# Altium project 23D_ESC_Controller.PrjPcb
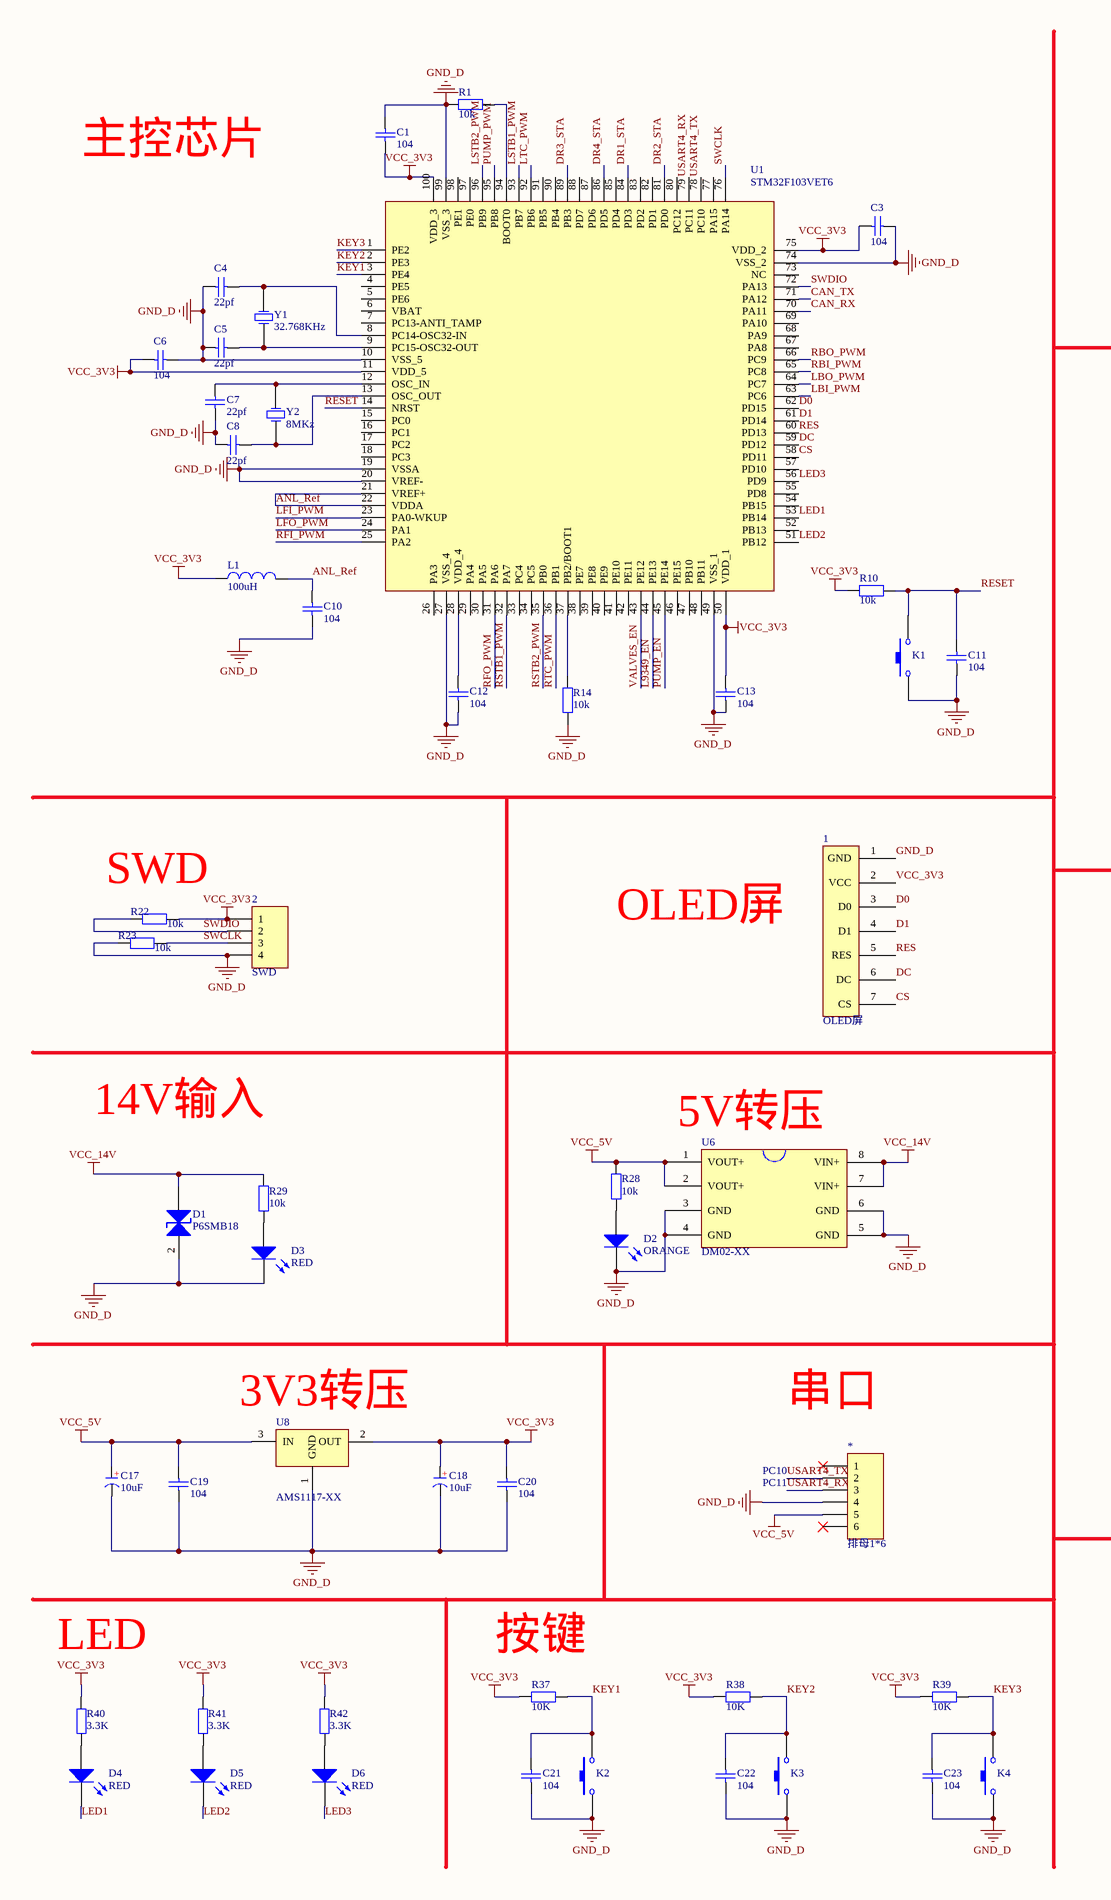
[diagram p0: 23D_ESC_Controller.SchDoc, left]
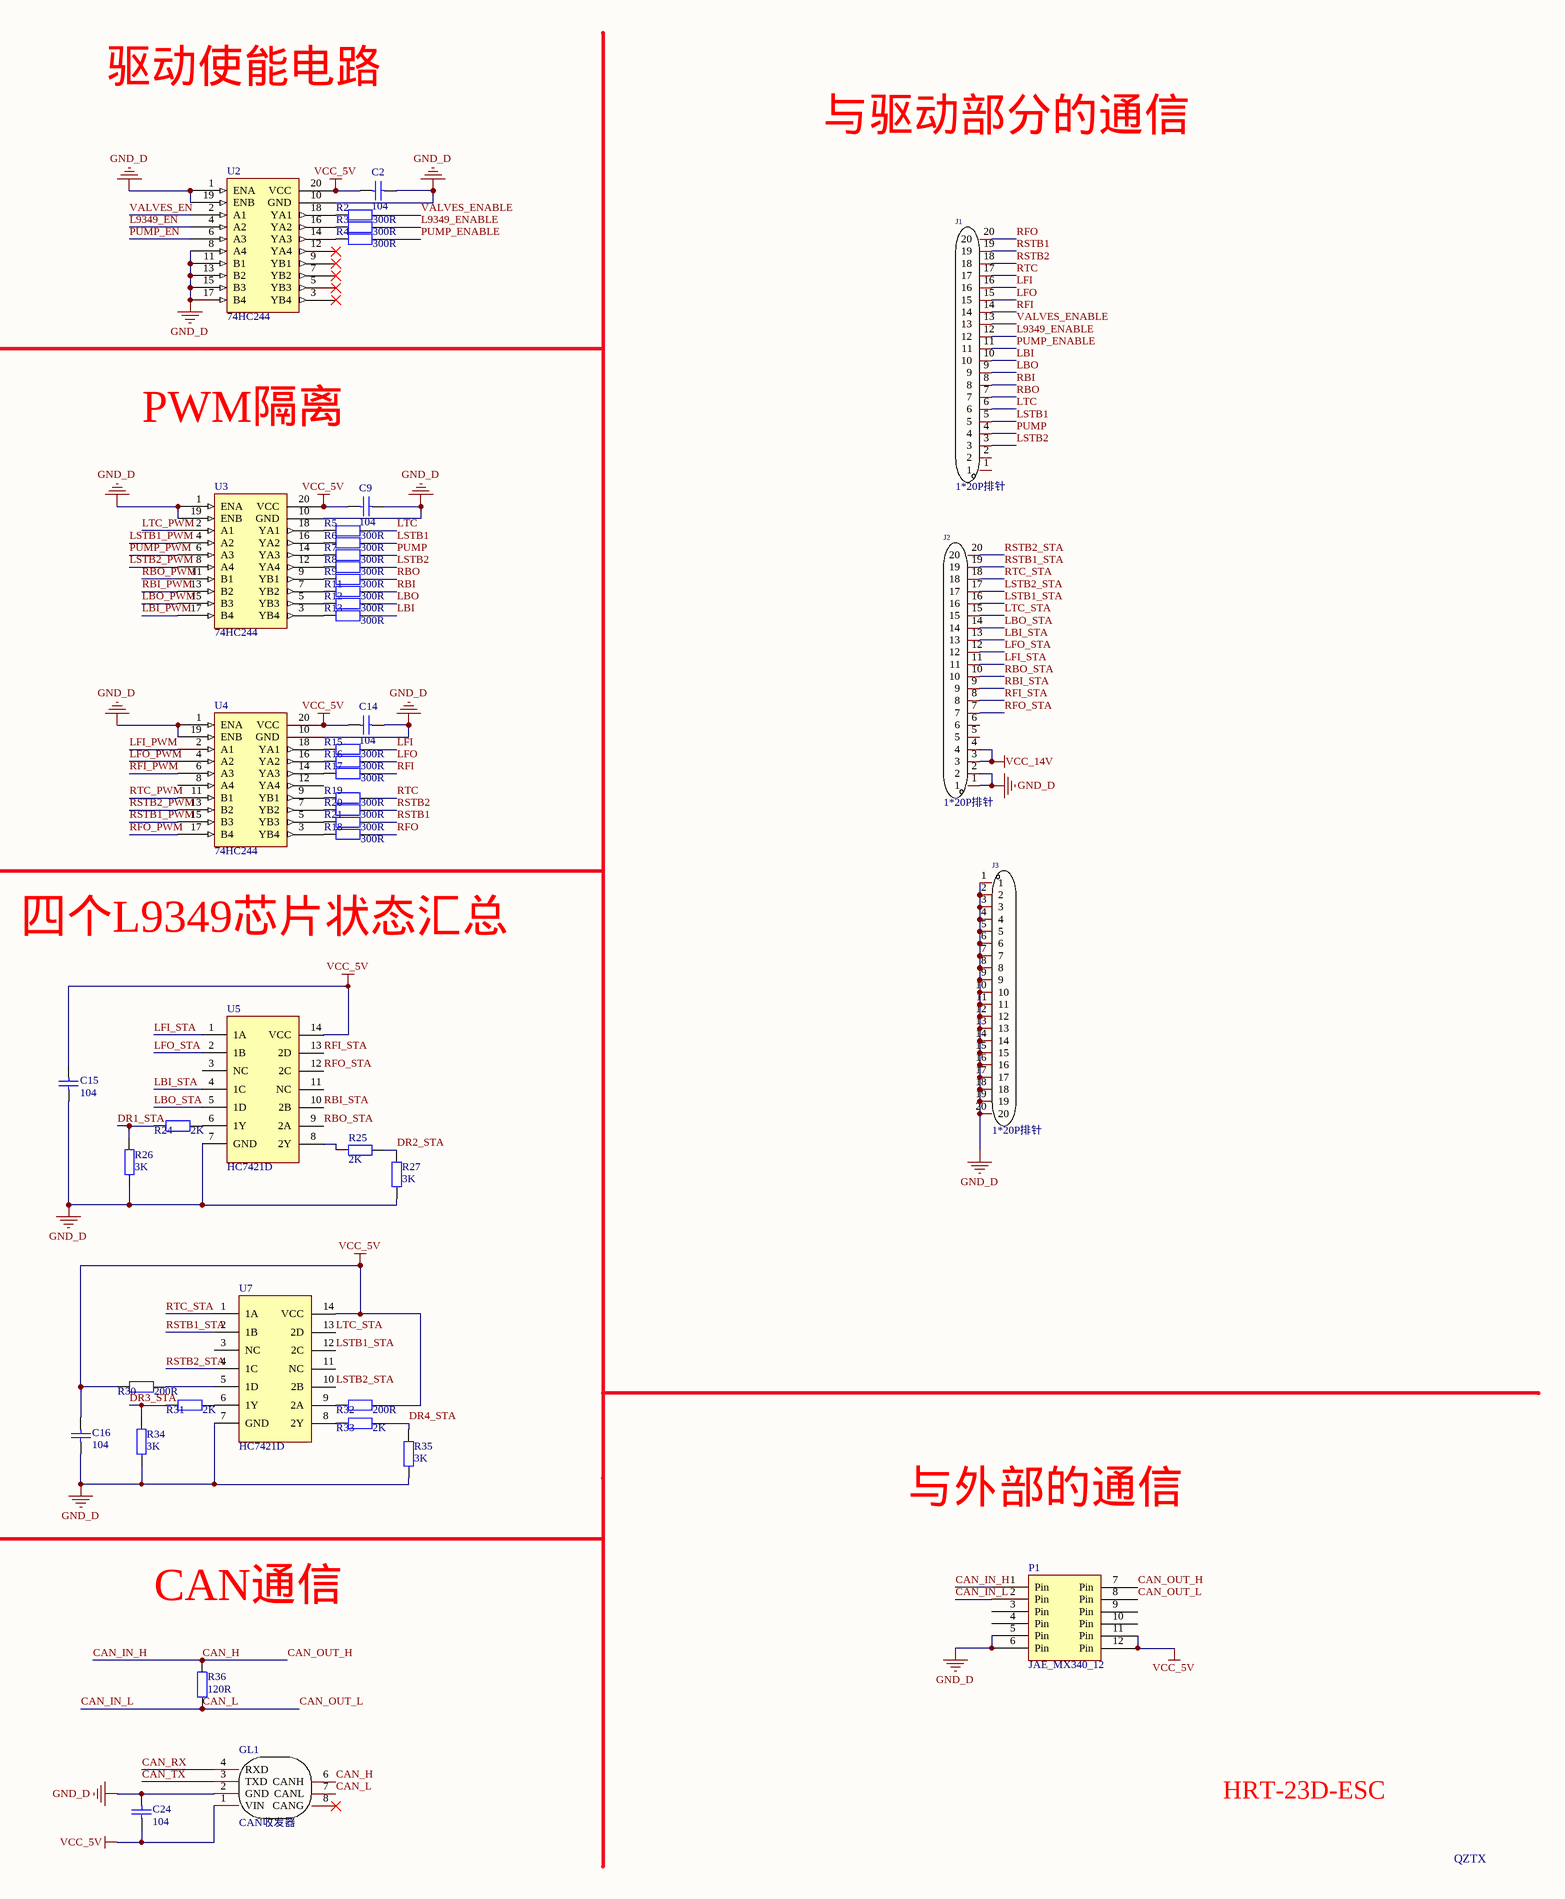
[diagram p1: 23D_ESC_Controller.SchDoc, right]
1 sheet, 95 parts. Net scope: global (net labels, ports and power ports of the same name join across sheets).
Board file: 23D_ESC_Controller.PcbDoc

## Sheet 23D_ESC_Controller.SchDoc
size A2

### Parts
1  OLED屏  [HDR2.54-M-LI-7P]
2  SWD  [HDR2.54-LI-4P]
*  排母1*6  [HDR2.54-M-LI-6P]
C1  104  [C 0805]
C2  104  [C 0805]
C3  104  [C 0805]
C4  22pf  [C 0805]
C5  22pf  [C 0805]
C6  104  [C 0805]
C7  22pf  [C 0805]
C8  22pf  [C 0805]
C9  104  [C 0805]
C10  104  [C 0805]
C11  104  [C 0805]
C12  104  [C 0805]
C13  104  [C 0805]
C14  104  [C 0805]
C15  104  [C 0805]
C16  104  [C 0805]
C17  10uF  [CD B(3528)]
C18  10uF  [CD B(3528)]
C19  104  [C 0805]
C20  104  [C 0805]
C21  104  [C 0805]
C22  104  [C 0805]
C23  104  [C 0805]
C24  104  [C 0805]
D1  P6SMB18  [DO-214AA]
D2  ORANGE  [LED_0805]
D3  RED  [LED_0805]
D4  RED  [LED_0805]
D5  RED  [LED_0805]
D6  RED  [LED_0805]
GL1  Name: CAN收发器  [COMM-TH_7P-L19.9-W17.5-P2.54]  (hidden comment: CTM1051KT)
J1  Name: 1*20P排针  [HDR-TH_20P-P2.54-V-M-1]  (hidden comment: 2.54-1*20P直针)
J2  Name: 1*20P排针  [HDR-TH_20P-P2.54-V-M-1]  (hidden comment: 2.54-1*20P直针)
J3  Name: 1*20P排针  [HDR2.54-LI-20P]  (hidden comment: 2.54-1*20P直针)
K1  Key  [KEY 3.6*2.5 SMD]  (value not drawn)
K2  Key  [KEY 3.6*2.5 SMD]  (value not drawn)
K3  Key  [KEY 3.6*2.5 SMD]  (value not drawn)
K4  Key  [KEY 3.6*2.5 SMD]  (value not drawn)
L1  100uH  [L 0805]
P1  JAE_MX340_12  [JAE_MX34_2.2_12]
R1  10k  [R 0805]
R2  300R  [R 0805]
R3  300R  [R 0805]
R4  300R  [R 0805]
R5  300R  [R 0805]
R6  300R  [R 0805]
R7  300R  [R 0805]
R8  300R  [R 0805]
R9  300R  [R 0805]
R10  10k  [R 0805]
R11  300R  [R 0805]
R12  300R  [R 0805]
R13  300R  [R 0805]
R14  10k  [R 0805]
R15  300R  [R 0805]
R16  300R  [R 0805]
R17  300R  [R 0805]
R18  300R  [R 0805]
R19  300R  [R 0805]
R20  300R  [R 0805]
R21  300R  [R 0805]
R22  10k  [R 0805]
R23  10k  [R 0805]
R24  2K  [R 0805]
R25  2K  [R 0805]
R26  3K  [R 0805]
R27  3K  [R 0805]
R28  10k  [R 0805]
R29  10k  [R 0805]
R30  200R  [R 0805]
R31  2K  [R 0805]
R32  200R  [R 0805]
R33  2K  [R 0805]
R34  3K  [R 0805]
R35  3K  [R 0805]
R36  120R  [R 0805]
R37  10K  [R 0805]
R38  10K  [R 0805]
R39  10K  [R 0805]
R40  3.3K  [R 0805]
R41  3.3K  [R 0805]
R42  3.3K  [R 0805]
U1  STM32F103VET6  [TQFP100N50P14X14X1.2]
U2  74HC244  [SSOP20]
U3  74HC244  [SSOP20]
U4  74HC244  [SSOP20]
U5  HC7421D  [74hc74]
U6  DM02-XX  [DM02]
U7  HC7421D  [74hc74]
U8  AMS1117-XX  [SOT223]
Y1  32.768KHz  [XTAL-5032]
Y2  8MKz  [XTAL-5032]

### Nets
GND_D: 1.1(GND) 2.4 *.4 C1.2 C2.2 C3.1 C4.2 C5.2 C6.1 C7.1 C8.2 C9.1 C10.2 C11.2 C12.2 C13.2 C14.2 C15.2 C16.2 C17.2(K) C18.2(K) C19.2 C20.2 C21.2 C22.2 C23.2 C24.1 D1.2(K) D2.2(K) D3.2(K) GL1.2(GND) J2.1 J2.2 J3.1 J3.2 J3.3 J3.4 J3.5 J3.6 J3.7 J3.8 J3.9 J3.10 J3.11 J3.12 J3.13 J3.14 J3.15 J3.16 J3.17 J3.18 J3.19 J3.20 K1.1 K2.1 K3.1 K4.1 P1.5(Pin) P1.6(Pin) R1.2 R14.2 R23.1 R26.1 R27.2 R34.1 R35.2 U1.10(VSS_5) U1.19(VSSA) U1.20(VREF-) U1.27(VSS_4) U1.49(VSS_1) U1.74(VSS_2) U1.99(VSS_3) U2.1(ENA) U2.8(A4) U2.10(GND) U2.11(B1) U2.13(B2) U2.15(B3) U2.17(B4) U2.19(ENB) U3.1(ENA) U3.10(GND) U3.19(ENB) U4.1(ENA) U4.10(GND) U4.19(ENB) U5.7(GND) U6.3(GND) U6.4(GND) U6.5(GND) U6.6(GND) U7.7(GND) U8.1(GND)
VCC_3V3: 1.2(VCC) 2.1 C1.1 C3.2 C6.2 C13.1 C18.1(A) C20.1 L1.1 R10.1 R22.2 R37.2 R38.2 R39.2 R40.2 R41.2 R42.2 U1.11(VDD_5) U1.50(VDD_1) U1.75(VDD_2) U1.100(VDD_3) U8.2(OUT)
VCC_5V: *.5 C2.1 C9.2 C14.1 C15.1 C16.1 C17.1(A) C19.1 C24.2 GL1.1(VIN) P1.11(Pin) P1.12(Pin) R28.2 R30.2 R32.1 U2.20(VCC) U3.20(VCC) U4.20(VCC) U5.14(VCC) U6.1(VOUT+) U6.2(VOUT+) U7.14(VCC) U8.3(IN)
VCC_14V: D1.1(A) J2.3 J2.4 R29.2 U6.7(VIN+) U6.8(VIN+)
ANL_Ref: C10.1 L1.2 U1.21(VREF+) U1.22(VDDA)
CAN_H: GL1.6(CANH) P1.1(Pin) P1.7(Pin) R36.1  [also labelled CAN_IN_H, CAN_OUT_H]
CAN_IN_L: GL1.7(CANL) P1.2(Pin) P1.8(Pin) R36.2  [also labelled CAN_L, CAN_OUT_L]
CAN_RX: GL1.4(RXD) U1.70(PA11)
CAN_TX: GL1.3(TXD) U1.71(PA12)
CS: 1.7(CS) U1.58(PD11)
D0: 1.3(D0) U1.62(PD15)
D1: 1.4(D1) U1.61(PD14)
DC: 1.6(DC) U1.59(PD12)
DR1_STA: R24.2 R26.2 U1.84(PD3)
DR2_STA: R25.2 R27.1 U1.81(PD0)
DR3_STA: R31.2 R34.2 U1.89(PB3)
DR4_STA: R33.1 R35.1 U1.86(PD5)
KEY1: C21.1 K2.2 R37.1 U1.3(PE4)
KEY2: C22.1 K3.2 R38.1 U1.2(PE3)
KEY3: C23.1 K4.2 R39.1 U1.1(PE2)
L9349_EN: U1.44(PE13) U2.4(A2)
L9349_ENABLE: J1.12 R3.2
LBI: J1.10 R13.2
LBI_PWM: U1.63(PC6) U3.17(B4)
LBI_STA: J2.13 U5.4(1C)
LBO: J1.9 R12.2
LBO_PWM: U1.64(PC7) U3.15(B3)
LBO_STA: J2.14 U5.5(1D)
LED1: D4.2(K) U1.53(PB14)
LED2: D5.2(K) U1.51(PB12)
LED3: D6.2(K) U1.56(PD9)
LFI: J1.16 R15.2
LFI_PWM: U1.23(PA0-WKUP) U4.2(A1)
LFI_STA: J2.11 U5.1(1A)
LFO: J1.15 R16.2
LFO_PWM: U1.24(PA1) U4.4(A2)
LFO_STA: J2.12 U5.2(1B)
LSTB1: J1.5 R6.2
LSTB1_PWM: U1.93(PB7) U3.4(A2)
LSTB1_STA: J2.16 U7.12(2C)
LSTB2: J1.3 R8.2
LSTB2_PWM: U1.96(PB9) U3.8(A4)
LSTB2_STA: J2.17 U7.10(2B)
LTC: J1.6 R5.2
LTC_PWM: U1.92(PB6) U3.2(A1)
LTC_STA: J2.15 U7.13(2D)
PUMP: J1.4 R7.2
PUMP_EN: U1.45(PE14) U2.6(A3)
PUMP_ENABLE: J1.11 R4.2
PUMP_PWM: U1.95(PB8) U3.6(A3)
RBI: J1.8 R11.2
RBI_PWM: U1.65(PC8) U3.13(B2)
RBI_STA: J2.9 U5.10(2B)
RBO: J1.7 R9.2
RBO_PWM: U1.66(PC9) U3.11(B1)
RBO_STA: J2.10 U5.9(2A)
RES: 1.5(RES) U1.60(PD13)
RESET: C11.1 K1.2 R10.2 U1.14(NRST)
RFI: J1.14 R17.2
RFI_PWM: U1.25(PA2) U4.6(A3)
RFI_STA: J2.8 U5.13(2D)
RFO: J1.20 R18.2
RFO_PWM: U1.31(PA6) U4.17(B4)
RFO_STA: J2.7 U5.12(2C)
RSTB1: J1.19 R21.2
RSTB1_PWM: U1.32(PA7) U4.15(B3)
RSTB1_STA: J2.19 U7.2(1B)
RSTB2: J1.18 R20.2
RSTB2_PWM: U1.35(PB0) U4.13(B2)
RSTB2_STA: J2.20 U7.4(1C)
RTC: J1.17 R19.2
RTC_PWM: U1.36(PB1) U4.11(B1)
RTC_STA: J2.18 U7.1(1A)
SWCLK: 2.3 R23.2 U1.76(PA14)
SWDIO: 2.2 R22.1 U1.72(PA13)
USART4_RX: *.3 U1.79(PC11)
USART4_TX: *.2 U1.78(PC10)
VALVES_EN: U1.43(PE12) U2.2(A1)
VALVES_ENABLE: J1.13 R2.2
NetC4_1: C4.1 U1.8(PC14-OSC32-IN) Y1.2(OSC2)
NetC5_1: C5.1 U1.9(PC15-OSC32-OUT) Y1.1(OSC1)
NetC7_2: C7.2 U1.12(OSC_IN) Y2.2(OSC2)
NetC8_1: C8.1 U1.13(OSC_OUT) Y2.1(OSC1)
NetC12_1: C12.1 U1.28(VDD_4)
NetD2_1: D2.1(A) R28.1
NetD3_1: D3.1(A) R29.1
NetD4_1: D4.1(A) R40.1
NetD5_1: D5.1(A) R41.1
NetD6_1: D6.1(A) R42.1
NetR1_1: R1.1 U1.94(BOOT0)
NetR2_1: R2.1 U2.18(YA1)
NetR3_1: R3.1 U2.16(YA2)
NetR4_1: R4.1 U2.14(YA3)
NetR5_1: R5.1 U3.18(YA1)
NetR6_1: R6.1 U3.16(YA2)
NetR7_1: R7.1 U3.14(YA3)
NetR8_1: R8.1 U3.12(YA4)
NetR9_1: R9.1 U3.9(YB1)
NetR11_1: R11.1 U3.7(YB2)
NetR12_1: R12.1 U3.5(YB3)
NetR13_1: R13.1 U3.3(YB4)
NetR14_1: R14.1 U1.37(PB2/BOOT1)
NetR15_1: R15.1 U4.18(YA1)
NetR16_1: R16.1 U4.16(YA2)
NetR17_1: R17.1 U4.14(YA3)
NetR18_1: R18.1 U4.3(YB4)
NetR19_1: R19.1 U4.9(YB1)
NetR20_1: R20.1 U4.7(YB2)
NetR21_1: R21.1 U4.5(YB3)
NetR24_1: R24.1 U5.6(1Y)
NetR25_1: R25.1 U5.8(2Y)
NetR30_1: R30.1 U7.5(1D)
NetR31_1: R31.1 U7.6(1Y)
NetR32_2: R32.2 U7.9(2A)
NetR33_2: R33.2 U7.8(2Y)

Not connected (* = marked no-connect by the designer): * 1* 6*; GL1 8(CANG)*; J1 1 2; J2 5 6; P1 3(Pin) 4(Pin) 9(Pin) 10(Pin); U1 4(PE5) 5(PE6) 6(VBAT) 7(PC13-ANTI_TAMP) 15(PC0) 16(PC1) 17(PC2) 18(PC3) 26(PA3) 29(PA4) 30(PA5) 33(PC4) 34(PC5) 38(PE7) 39(PE8) 40(PE9) 41(PE10) 42(PE11) 46(PE15) 47(PB10) 48(PB11) 52(PB13) 54(PB15) 55(PD8) 57(PD10) 67(PA8) 68(PA9) 69(PA10) 73(NC) 77(PA15) 80(PC12) 82(PD1) 83(PD2) 85(PD4) 87(PD6) 88(PD7) 90(PB4) 91(PB5) 97(PE0) 98(PE1); U2 3(YB4)* 5(YB3)* 7(YB2)* 9(YB1)* 12(YA4)*; U4 8(A4) 12(YA4); U5 3(NC) 11(NC); U7 3(NC) 11(NC)

### Notes on the sheet
- 驱动使能电路
- 主控芯片
- 与驱动部分的通信
- PWM隔离
- (near R22) SWD
- OLED屏
- 四个L9349芯片状态汇总
- 14V输入
- (near U6) 5V转压
- (near U8) 3V3转压
- 串口
- PC10
- PC11
- 与外部的通信
- CAN通信
- LED
- (near R37) 按键
- HRT-23D-ESC
- QZTX
- (in symbol 贴片钽电容) +

### Library data of the parts
2 = 排针1*4
C1-C16 C19-C24 = Cap: 无极性电容
C17 C18 = 贴片钽电容
D1 = P6SMBXX: BiDir TVS Diode
D2-D6 = LED: 发光二极管
GL1 = CTM1051KT_C84516: 兼容3.3V和5V的单片机CAN接口，CAN隔离收发器 5V供电; Manufacturer: ZLG(致远电子); Add into BOM: yes; Symbol: CTM1051KT; Device: CTM1051KT_C84516; LCSC Part Name: CAN隔离收发器 5V供电; Supplier Part: C84516; Manufacturer Part: CTM1051KT; Supplier Footprint: DIP-7; JLCPCB Part Class: 扩展库; Datasheet: https://atta.szlcsc.com/upload/public/pdf/source/20161014/1476441644172.pdf; Supplier: LCSC; Convert to PCB: yes
J1-J3 = 2.54-1*20P直针: 排数:单排;总PIN位数:20;间距:2.54mm;插针结构:1x20P;行距:-;安装类型:直插;圆针/方针:方针;额定电流:3A;额定电压:-;配合针长度:-;塑高:-;端接针长度:-;触头材质:黄铜;触头镀层:-;工作温度范围:-40℃~+105℃;颜色:黑色;; Manufacturer: BOOMELE(博穆精密); Symbol: Header-Male-2.54_1x20; Add into BOM: yes; Pitch: 2.54mm; Pin Structure: 1x20P; Circluar Pins/Square Pins: 方针; Current Rating (Max): 3A; Device: 2.54-1*20P直针; LCSC Part Name: 2.54mm 1x20P 直插 方针; Supplier Part: C50981; Manufacturer Part: 2.54-1*20P直针; Supplier Footprint: 直插,P=2.54mm; JLCPCB Part Class: 扩展库; Supplier: LCSC; Convert to PCB: yes; Number of Rows: 单排; Number of Pins: 20; Row Spacing: -; Mounting Type: 直插; Voltage Rating (Max): -; Length of Mating Pin: -; Insulation Height: -; Length of End Connection Pin: -; Contact Material: 黄铜; Contact Plating: -; Operating Temperature Range: -40℃~+105℃; Color: 黑色
K1-K4 = Key: 按键
L1 = Inductor: 电感
P1 = JAE_MX34012NF1
R1-R42 = Resistor: 电阻
U1 = STM32F103RBT6: Published: 20110607
U2-U4 = 74HC244: CMOS工艺8通道缓冲器
U6 = DM02: 开关型DC-DC变换器
U8 = AMS1117: 线性稳压器
Y1 Y2 = XTAL: 晶振